# Altium project VaractorTline144Mhz.PrjPcb
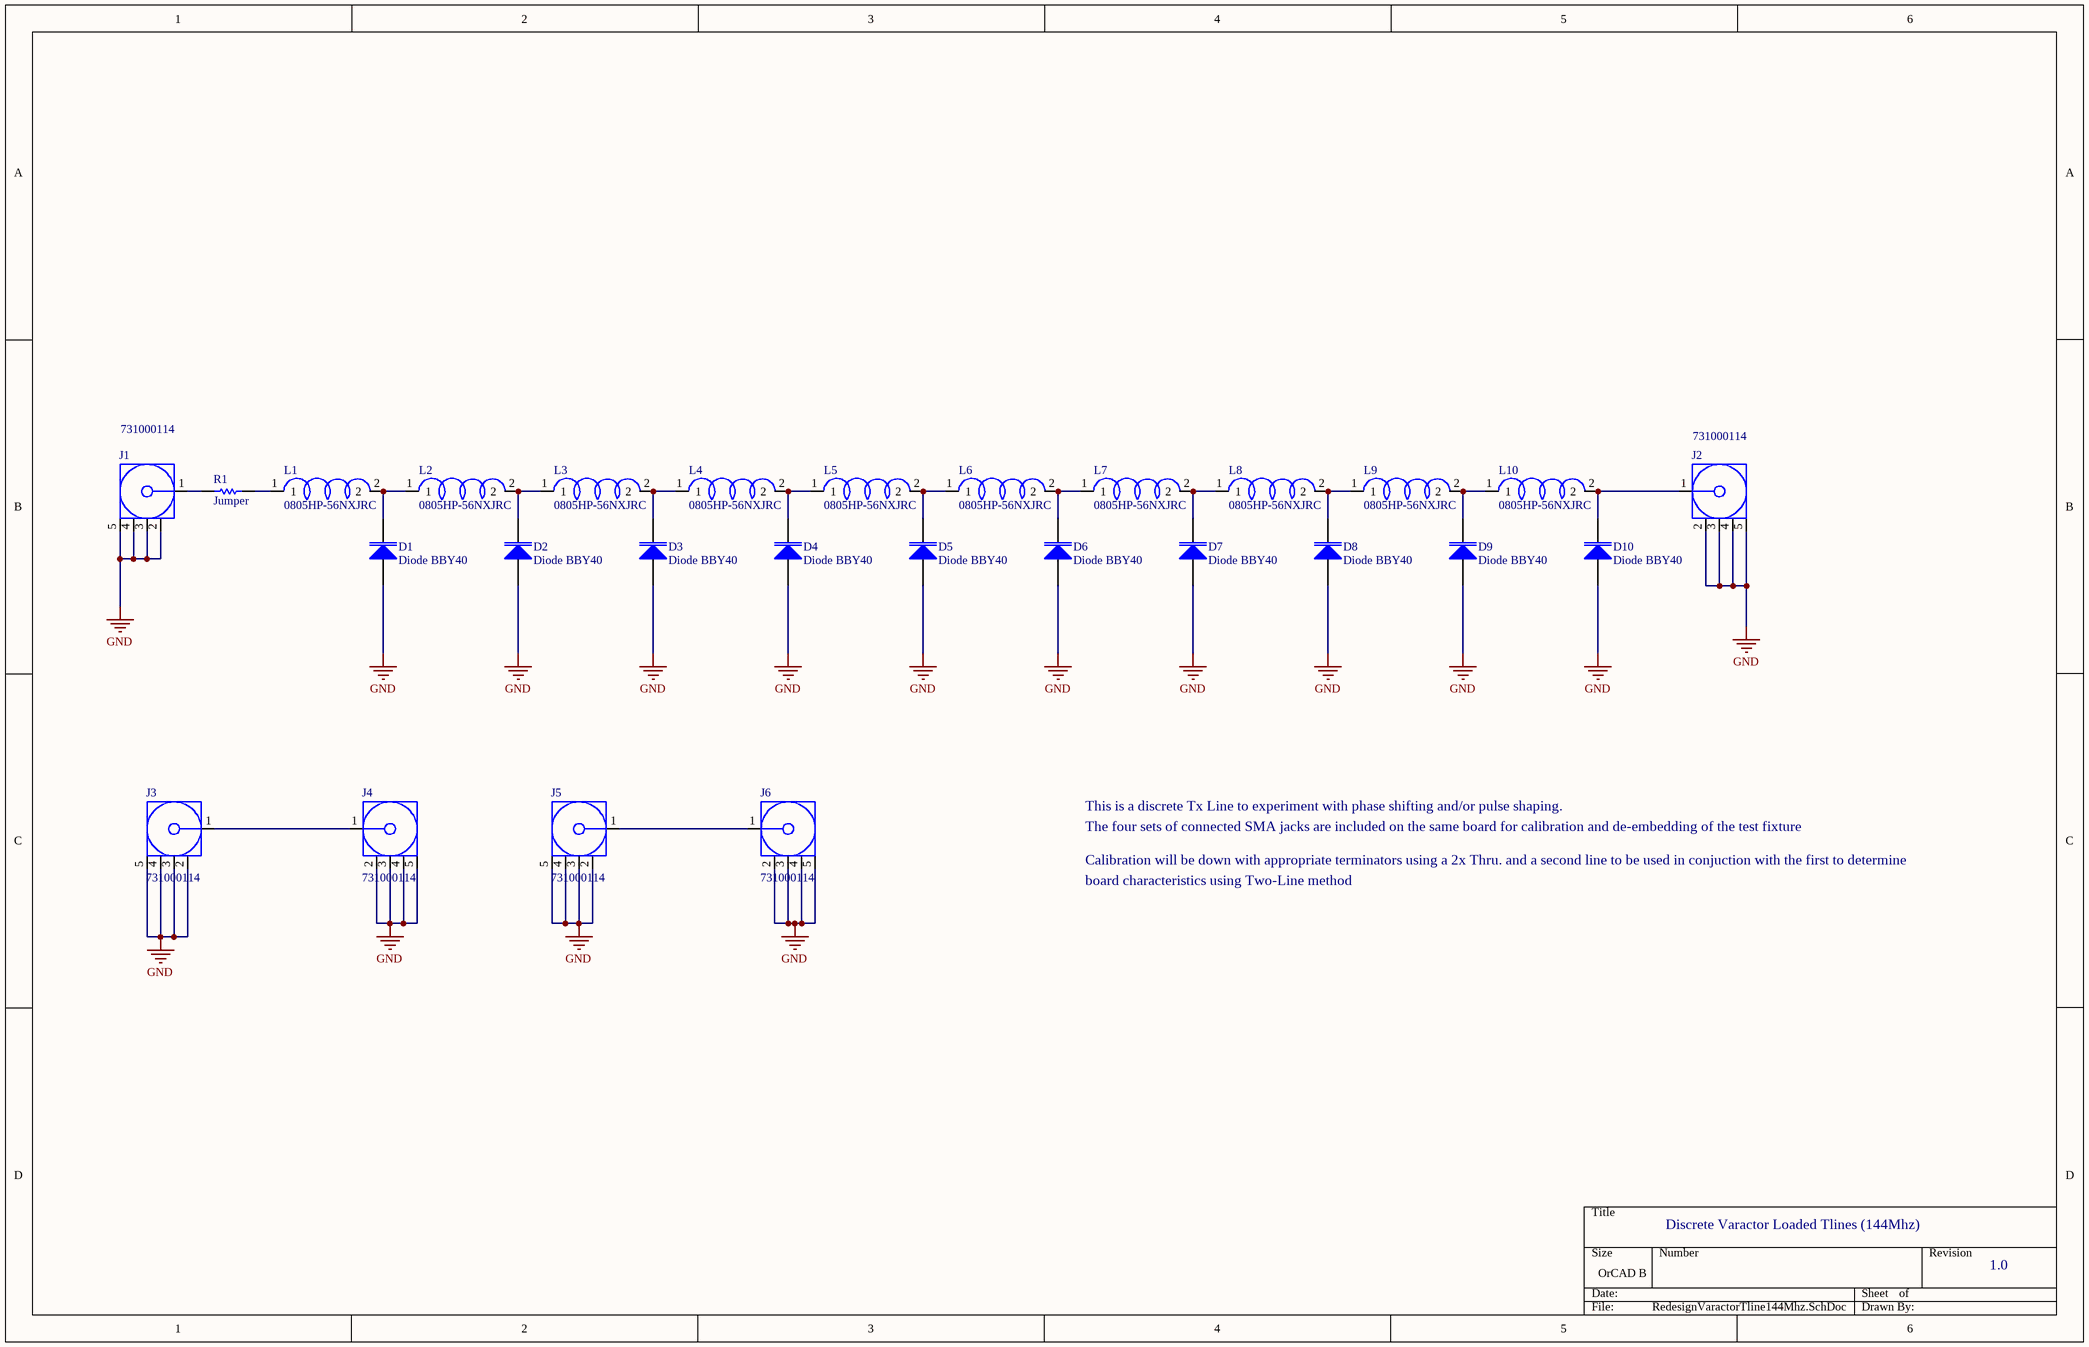
[diagram p0: RedesignVaractorTline144Mhz.SchDoc]
1 sheet, 27 parts. Net scope: global (net labels, ports and power ports of the same name join across sheets).
Board file: RedesignVaractorTline144Mhz.PcbDoc

## Sheet RedesignVaractorTline144Mhz.SchDoc
size OrCAD B

### Parts
D1  Diode BBY40  [SOT23_N]
D2  Diode BBY40  [SOT23_N]
D3  Diode BBY40  [SOT23_N]
D4  Diode BBY40  [SOT23_N]
D5  Diode BBY40  [SOT23_N]
D6  Diode BBY40  [SOT23_N]
D7  Diode BBY40  [SOT23_N]
D8  Diode BBY40  [SOT23_N]
D9  Diode BBY40  [SOT23_N]
D10  Diode BBY40  [SOT23_N]
J1  731000114  [MOLX-731000114_V]
J2  731000114  [MOLX-731000114_V]
J3  731000114  [MOLX-731000114_V]
J4  731000114  [MOLX-731000114_V]
J5  731000114  [MOLX-731000114_V]
J6  731000114  [MOLX-731000114_V]
L1  0805HP-56NXJRC  [0805HQ SERIES]
L2  0805HP-56NXJRC  [0805HQ SERIES]
L3  0805HP-56NXJRC  [0805HQ SERIES]
L4  0805HP-56NXJRC  [0805HQ SERIES]
L5  0805HP-56NXJRC  [0805HQ SERIES]
L6  0805HP-56NXJRC  [0805HQ SERIES]
L7  0805HP-56NXJRC  [0805HQ SERIES]
L8  0805HP-56NXJRC  [0805HQ SERIES]
L9  0805HP-56NXJRC  [0805HQ SERIES]
L10  0805HP-56NXJRC  [0805HQ SERIES]
R1  Jumper  [RESC2013X70X40NL20T20]

### Nets
GND: D1.3(A) D2.3(A) D3.3(A) D4.3(A) D5.3(A) D6.3(A) D7.3(A) D8.3(A) D9.3(A) D10.3(A) J1.2 J1.3 J1.4 J1.5 J2.2 J2.3 J2.4 J2.5 J3.2 J3.3 J3.4 J3.5 J4.2 J4.3 J4.4 J4.5 J5.2 J5.3 J5.4 J5.5 J6.2 J6.3 J6.4 J6.5
NetD1_1: D1.1(K) L1.2 L2.1
NetD2_1: D2.1(K) L2.2 L3.1
NetD3_1: D3.1(K) L3.2 L4.1
NetD4_1: D4.1(K) L4.2 L5.1
NetD5_1: D5.1(K) L5.2 L6.1
NetD6_1: D6.1(K) L6.2 L7.1
NetD7_1: D7.1(K) L7.2 L8.1
NetD8_1: D8.1(K) L8.2 L9.1
NetD9_1: D9.1(K) L9.2 L10.1
NetD10_1: D10.1(K) J2.1 L10.2
NetJ1_1: J1.1 R1.1
NetJ3_1: J3.1 J4.1
NetJ5_1: J5.1 J6.1
NetL1_1: L1.1 R1.2

### Notes on the sheet
- This is a discrete Tx Line to experiment with phase shifting and/or pulse shaping.
- The four sets of connected SMA jacks are included on the same board for calibration and de-embedding of the test fixture
- Calibration will be down with appropriate terminators using a 2x Thru. and a second line to be used in conjuction with the first to determine
- board characteristics using Two-Line method
- Discrete Varactor Loaded Tlines (144Mhz)
- 1.0

### Library data of the parts
D1-D10 = Diode BBY40: SOT23 Silicon Planar Variable Capacitance Diode; Note: Pin 2 is not connected and not drawn.; Published: 8-Jun-2000; LatestRevisionDate: 29-May-2009; LatestRevisionNote: IPC-7351 Footprint Added.; DatasheetVersion: Jan-1998; PackageVersion: 1996; PackageReference: SOT23; Publisher: Altium Limited; PackageDescription: 3-Pin SOT-23 Package 0.95 mm Pitch, 2.3 mm Lead Span - Reverse Pinning; ComponentLink1Description: Manufacturer Link; ComponentLink1URL: http://www.zetex.com/; ComponentLink2Description: Datasheet; ComponentLink2URL: www.zetex.com/3.0/pdf/BBY40.pdf
J1-J6 = CMP-2000-05487-1: SMA Right-Angle PCB Jack Receptacle, Brass Body, Gold Plated, 50 Ohm, 5-Pin THD, RoHS, Tray; Manufacturer: Molex; Datasheet Version: 09/2016; Package Description: 5-Pin Through Hole Device, Body 14.8 x 6.35 mm, Pitch 2.54 mm; Datasheet URL: http://www.molex.com/webdocs/datasheets/pdf/en-us/0731000114_RF_COAX_CONNECTORS.pdf; Manufacturer URL: http://www.molex.com/; Package Reference: 731000114; Mounting Technology: ThroughHole; Package URL: http://www.molex.com/pdm_docs/sd/731000114_sd.pdf
L1-L10 = 0805HP-56NXJRC: 0805HP-56NXJRC Coilcraft Variable Inductor; ComponentLink1Description: Datasheet; ComponentLink1URL: https://www.coilcraft.com/0805hp.cfm; Manufacturer: Coilcraft; Unit Price: $0.82
R1 = CMP-1665-00002-5: Chip Resistor, 0 Ohm, +/- 1%, 0.125 W, -55 to 155 degC, 0805 (2012 Metric), RoHS, Tape and Reel; PartNumber: ERJ-6GEY0R00V; Tolerance: 5%; Resistance: 0 Ohm; REACH SVHC: No SVHC; Min Operating Temperature: -55 degC; Case/Package: 0805; Packaging: Tape and Reel; Package Quantity: 5000; ComponentLink1Description: Manufacturer URL; PackageDescription: 2-Pin Surface Mount Device, Body 2 x 1.25 mm; Mounting Technology: Surface Mount; Max Operating Temperature: 155 degC; Width: 1.25 mm; RoHSCompliant: True; Height: 0.6 mm; ComponentLink1URL: http://www.panasonic.com/; ComponentLink2URL: http://industrial.panasonic.com/cdbs/www-data/pdf/RDA0000/AOA0000C84.pdf; Case Code (Imperial): 0805; DatasheetVersion: 03/2015; Length: 2 mm; Case Code (Metric): 2012; ComponentLink2Description: Datasheet; Radiation Hardening: No